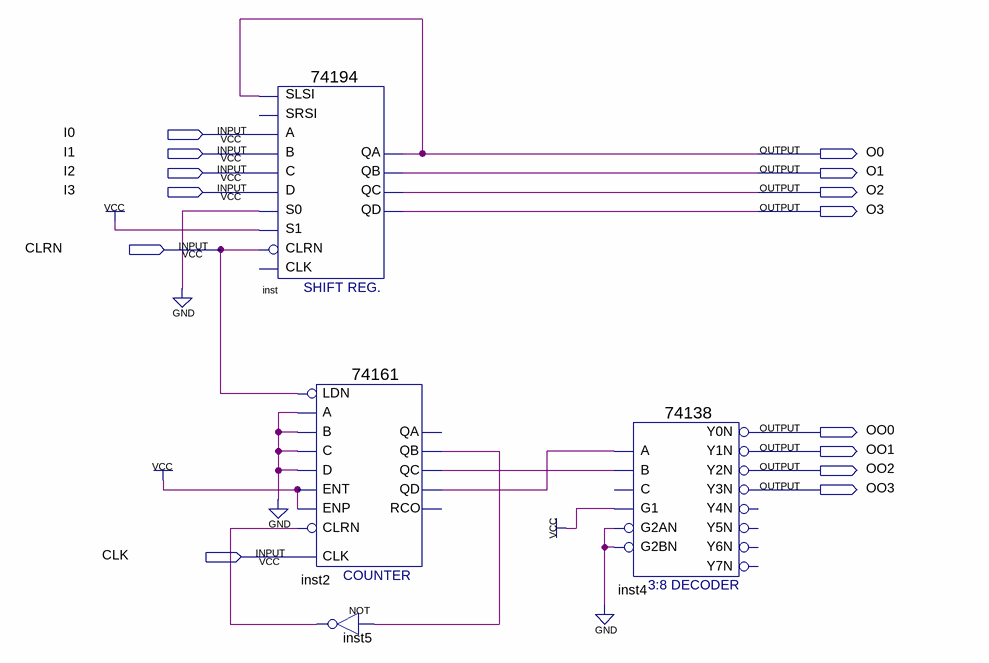
[diagram p0: schematic sheet]
// Quartus schematic COADEXP4.bdf as structural Verilog: 4 symbols, 14 pins
module COADEXP4 (
  input  I0,
  input  I1,
  input  I2,
  input  I3,
  input  CLRN,
  input  CLK,
  output O0,
  output O1,
  output O2,
  output O3,
  output OO0,
  output OO1,
  output OO2,
  output OO3
);

  wire inst2_qb, inst2_qc, inst2_qd, inst5_out;

  \74194  inst (
    .SLSI(O0), .B(I1), .C(I2), .CLRN(CLRN), .D(I3), .S1(1'b1), .S0(1'b0), .A(I0), .QA(O0), .QB(O1), .QC(O2),
    .QD(O3));  // open: SRSI, CLK
  \74161  inst2 (
    .CLRN(inst5_out), .CLK(CLK), .ENP(1'b1), .LDN(CLRN), .A(1'b0), .D(1'b0), .ENT(1'b1), .B(1'b0), .C(1'b0),
    .QD(inst2_qd), .QC(inst2_qc), .QB(inst2_qb));  // open: QA, RCO
  not inst5 (inst5_out, inst2_qb);
  \74138  inst4 (
    .A(inst2_qd), .B(inst2_qc), .G1(1'b1), .G2AN(1'b0), .G2BN(1'b0), .Y0N(OO0), .Y1N(OO1), .Y2N(OO2),
    .Y3N(OO3));  // open: C, Y4N, Y5N, Y6N, Y7N
endmodule
